# Altium schematic sheet DUT.SchDoc
size 420 x 297 mm; SheetNumber: 4; SheetTotal: 5
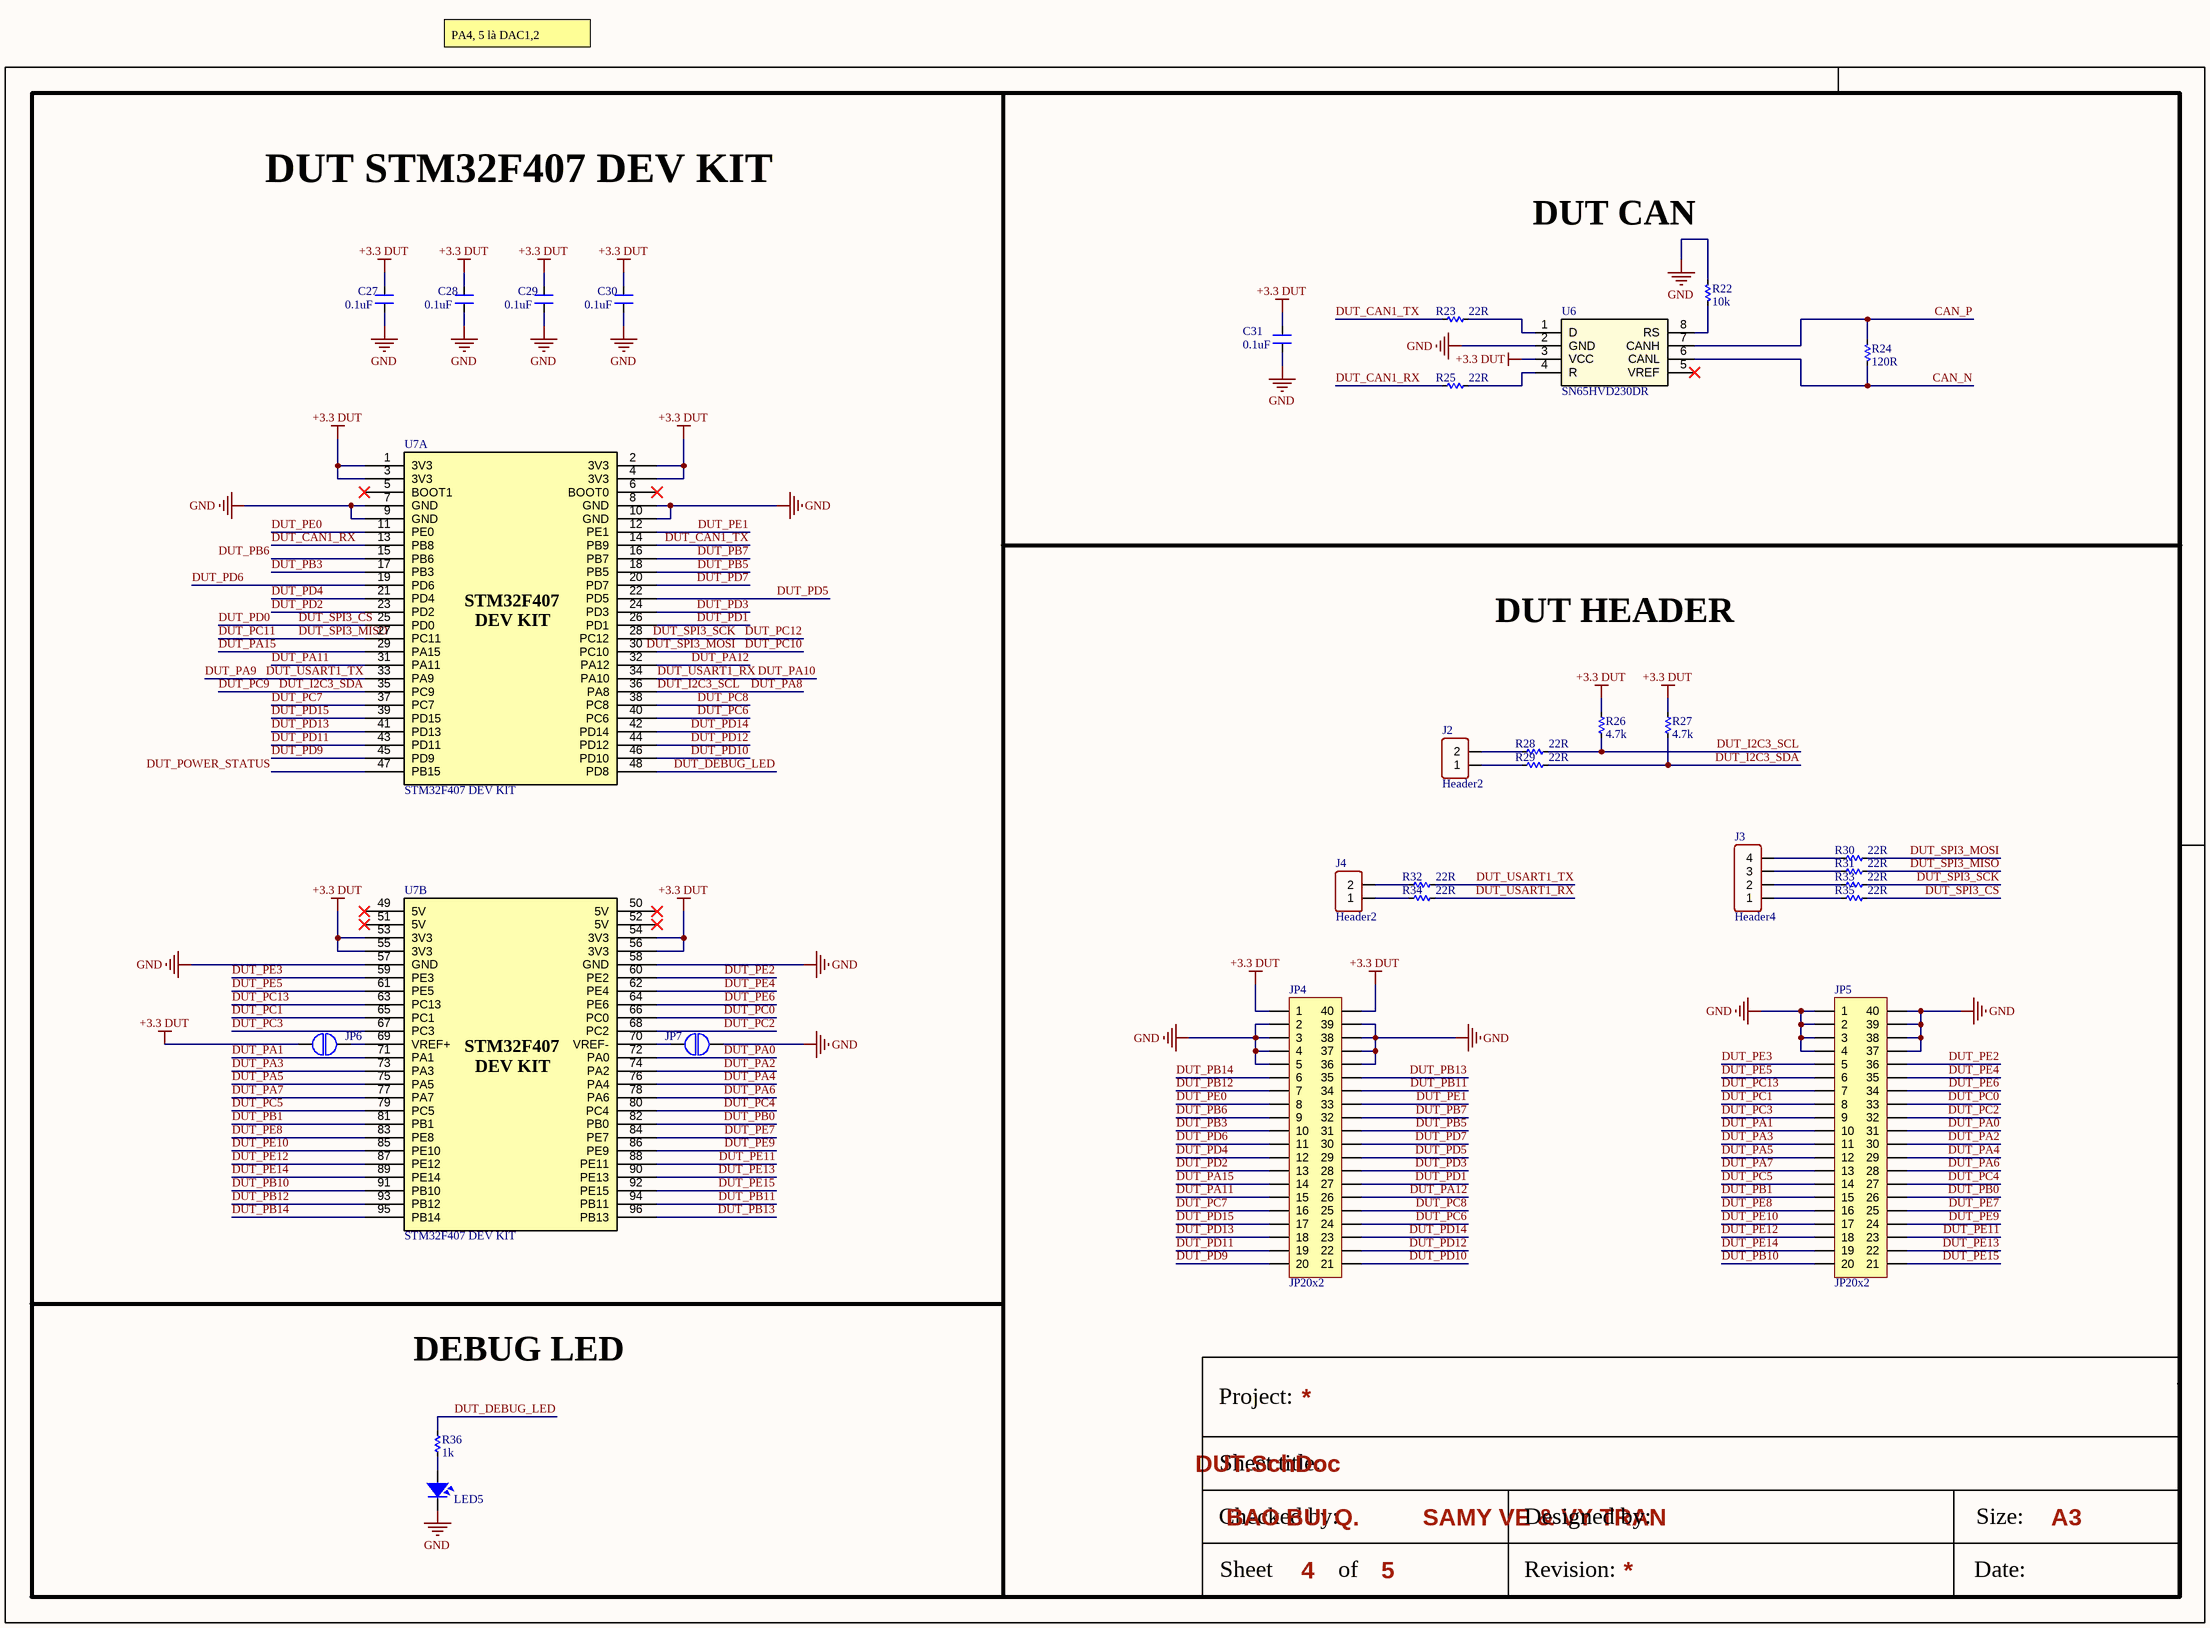
[diagram p0: DUT.SchDoc]

## Parts
C27  0.1uF  [CN-SMD-0603]
C28  0.1uF  [CN-SMD-0603]
C29  0.1uF  [CN-SMD-0603]
C30  0.1uF  [CN-SMD-0603]
C31  0.1uF  [CN-SMD-0603]
J2  Header2  [XH2.54-2-DIP]
J3  Header4  [XH2.54-4-DIP]
J4  Header2  [XH2.54-2-DIP]
JP4  JP20x2  [JP20-D2T]
JP5  JP20x2  [JP20-D2T]
JP6  JUMP2  [Jump2]  (value not drawn)
JP7  JUMP2  [Jump2]  (value not drawn)
LED5  LED  [LED-0805-Red]  (value not drawn)
R22  10k  [RES-SMD-0603]
R23  22R  [RES-SMD-0603]
R24  120R  [RES-SMD-0603]
R25  22R  [RES-SMD-0603]
R26  4.7k  [RES-SMD-0603]
R27  4.7k  [RES-SMD-0603]
R28  22R  [RES-SMD-0603]
R29  22R  [RES-SMD-0603]
R30  22R  [RES-SMD-0603]
R31  22R  [RES-SMD-0603]
R32  22R  [RES-SMD-0603]
R33  22R  [RES-SMD-0603]
R34  22R  [RES-SMD-0603]
R35  22R  [RES-SMD-0603]
R36  1k  [RES-SMD-0603]
U6  SN65HVD230DR  [SO8]
U7  STM32F407 DEV KIT  [STM32F407 DEV KIT]  (parts A,B of 2)

## Nets
+3.3 DUT: C27.1 C28.1 C29.1 C30.1 C31.1 JP4.1 JP4.40 JP6.1 R26.1 R27.1 U6.3(VCC) U7.1(3V3) U7.2(3V3) U7.3(3V3) U7.4(3V3) U7.53(3V3) U7.54(3V3) U7.55(3V3) U7.56(3V3)
GND: C27.2 C28.2 C29.2 C30.2 C31.2 JP4.2 JP4.3 JP4.4 JP4.5 JP4.36 JP4.37 JP4.38 JP4.39 JP5.1 JP5.2 JP5.3 JP5.4 JP5.37 JP5.38 JP5.39 JP5.40 JP7.2 LED5.2 R22.1 U6.2(GND) U7.7(GND) U7.8(GND) U7.9(GND) U7.10(GND) U7.57(GND) U7.58(GND)
CAN_N: R24.2 U6.6(CANL)
CAN_P: R24.1 U6.7(CANH)
DUT_CAN1_RX: R25.2 U7.13(PB8)
DUT_CAN1_TX: R23.2 U7.14(PB9)
DUT_DEBUG_LED: R36.2 U7.48(PD8)
DUT_I2C3_SCL: R26.2 R28.1 U7.36(PA8)  [also labelled DUT_PA8]
DUT_I2C3_SDA: R27.2 R29.1 U7.35(PC9)  [also labelled DUT_PC9]
DUT_PA0: JP5.31 U7.72(PA0)
DUT_PA1: JP5.10 U7.71(PA1)
DUT_PA2: JP5.30 U7.74(PA2)
DUT_PA3: JP5.11 U7.73(PA3)
DUT_PA4: JP5.29 U7.76(PA4)
DUT_PA5: JP5.12 U7.75(PA5)
DUT_PA6: JP5.28 U7.78(PA6)
DUT_PA7: JP5.13 U7.77(PA7)
DUT_PA9: R32.1 U7.33(PA9)  [also labelled DUT_USART1_TX]
DUT_PA10: R34.1 U7.34(PA10)  [also labelled DUT_USART1_RX]
DUT_PA11: JP4.15 U7.31(PA11)
DUT_PA12: JP4.26 U7.32(PA12)
DUT_PA15: JP4.14 U7.29(PA15)
DUT_PB0: JP5.26 U7.82(PB0)
DUT_PB1: JP5.15 U7.81(PB1)
DUT_PB3: JP4.10 U7.17(PB3)
DUT_PB5: JP4.31 U7.18(PB5)
DUT_PB6: JP4.9 U7.15(PB6)
DUT_PB7: JP4.32 U7.16(PB7)
DUT_PB10: JP5.20 U7.91(PB10)
DUT_PB11: JP4.34 U7.94(PB11)
DUT_PB12: JP4.7 U7.93(PB12)
DUT_PB13: JP4.35 U7.96(PB13)
DUT_PB14: JP4.6 U7.95(PB14)
DUT_PC0: JP5.33 U7.66(PC0)
DUT_PC1: JP5.8 U7.65(PC1)
DUT_PC2: JP5.32 U7.68(PC2)
DUT_PC3: JP5.9 U7.67(PC3)
DUT_PC4: JP5.27 U7.80(PC4)
DUT_PC5: JP5.14 U7.79(PC5)
DUT_PC6: JP4.24 U7.40(PC6)
DUT_PC7: JP4.16 U7.37(PC7)
DUT_PC8: JP4.25 U7.38(PC8)
DUT_PC10: R30.1 U7.30(PC10)  [also labelled DUT_SPI3_MOSI]
DUT_PC11: R31.1 U7.27(PC11)  [also labelled DUT_SPI3_MISO]
DUT_PC12: R33.1 U7.28(PC12)  [also labelled DUT_SPI3_SCK]
DUT_PC13: JP5.7 U7.63(PC13)
DUT_PD0: R35.1 U7.25(PD0)  [also labelled DUT_SPI3_CS]
DUT_PD1: JP4.27 U7.26(PD1)
DUT_PD2: JP4.13 U7.23(PD2)
DUT_PD3: JP4.28 U7.24(PD3)
DUT_PD4: JP4.12 U7.21(PD4)
DUT_PD5: JP4.29 U7.22(PD5)
DUT_PD6: JP4.11 U7.19(PD6)
DUT_PD7: JP4.30 U7.20(PD7)
DUT_PD9: JP4.20 U7.45(PD9)
DUT_PD10: JP4.21 U7.46(PD10)
DUT_PD11: JP4.19 U7.43(PD11)
DUT_PD12: JP4.22 U7.44(PD12)
DUT_PD13: JP4.18 U7.41(PD13)
DUT_PD14: JP4.23 U7.42(PD14)
DUT_PD15: JP4.17 U7.39(PD15)
DUT_PE0: JP4.8 U7.11(PE0)
DUT_PE1: JP4.33 U7.12(PE1)
DUT_PE2: JP5.36 U7.60(PE2)
DUT_PE3: JP5.5 U7.59(PE3)
DUT_PE4: JP5.35 U7.62(PE4)
DUT_PE5: JP5.6 U7.61(PE5)
DUT_PE6: JP5.34 U7.64(PE6)
DUT_PE7: JP5.25 U7.84(PE7)
DUT_PE8: JP5.16 U7.83(PE8)
DUT_PE9: JP5.24 U7.86(PE9)
DUT_PE10: JP5.17 U7.85(PE10)
DUT_PE11: JP5.23 U7.88(PE11)
DUT_PE12: JP5.18 U7.87(PE12)
DUT_PE13: JP5.22 U7.90(PE13)
DUT_PE14: JP5.19 U7.89(PE14)
DUT_PE15: JP5.21 U7.92(PE15)
DUT_POWER_STATUS: U7.47(PB15)
NetJ2_1: J2.1 R29.2
NetJ2_2: J2.2 R28.2
NetJ3_1: J3.1 R35.2
NetJ3_2: J3.2 R33.2
NetJ3_3: J3.3 R31.2
NetJ3_4: J3.4 R30.2
NetJ4_1: J4.1 R34.2
NetJ4_2: J4.2 R32.2
NetJP6_2: JP6.2 U7.69(VREF+)
NetJP7_1: JP7.1 U7.70(VREF-)
NetLED5_1: LED5.1 R36.1
NetR22_2: R22.2 U6.8(RS)
NetR23_1: R23.1 U6.1(D)
NetR25_1: R25.1 U6.4(R)

Not connected (* = marked no-connect by the designer): U6 5(VREF)*; U7 5(BOOT1)* 6(BOOT0)* 49(5V)* 50(5V)* 51(5V)* 52(5V)*

## Notes on the sheet
- PA4, 5 là DAC1,2
- DUT STM32F407 DEV KIT
- DUT CAN
- DUT HEADER
- DEBUG LED
- Project:
- Sheet title:
- BAO BUI Q.
- SAMY VE & VY TRAN
- A3
- Sheet
- Checked by:
- of
- Revision:
- Designed by:
- Size:
- Date:
- (in symbol STM32F407 DEV KIT, part A) STM32F407; DEV KIT
- (in symbol STM32F407 DEV KIT, part B) STM32F407; DEV KIT

## Library data of the parts
C27-C31 = CN: Value: 33pF
J2 J4 = Header2: Connector 2; Manufacturer: W¨¹rth Elektronik eiSos GmbH; partNo: 613002143121; ComponentLink1 Description: Manufacturer; ComponentLink2 Description: Datasheet; NoPins: 02; Created Date: 29 March 2013; ComponentLink1URL: http://www.we-online.com; ComponentLink2URL: http://katalog.we-online.de/em/datasheet/6130xx143121.pdf; Created by: Karrer Zheng
J3 = Header4: Connector 4; Manufacturer: W¨¹rth Elektronik eiSos GmbH; partNo: 613002143121; ComponentLink1 Description: Manufacturer; ComponentLink2 Description: Datasheet; NoPins: 02; Created Date: 29 March 2013; ComponentLink1URL: http://www.we-online.com; ComponentLink2URL: http://katalog.we-online.de/em/datasheet/6130xx143121.pdf; Created by: Karrer Zheng
JP4 JP5 = JP20x2: WR-PHD 2.54 mm Dual Socket Header; Manufacturer: W¨¹rth Elektronik eiSos GmbH; partNo: 61304021821; ComponentLink1 Description: Manufacturer; ComponentLink2 Description: Datasheet; NoPins: 40; Created Date: 29 March 2013; ComponentLink1URL: http://www.we-online.com; ComponentLink2URL: http://katalog.we-online.de/em/datasheet/6130xx21821.pdf; Created by: Karrer Zheng
LED5 = LED SMD: Value: LED 3 - 5 ly 2 Colour
R22-R36 = Res-SMD: Resistor; Manufacturer: Generic Components; Class: Passive; Published: 08/06/2000; Publisher: Altium Hobart Technology Centre
U6 = SN65HVD251DR: IC TRANSCEIVER HALF 1/1 8SOIC